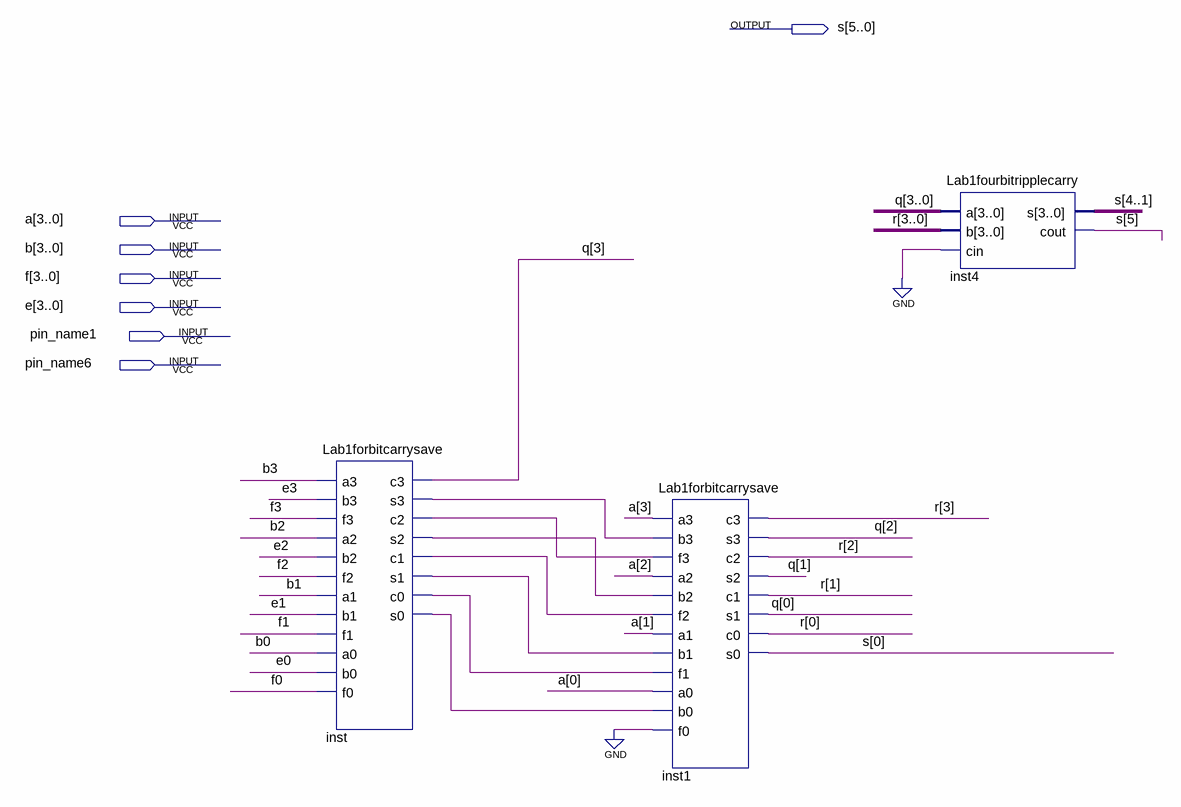
[diagram p0: schematic sheet]
// Quartus schematic forbitcarrysavefor.bdf as structural Verilog: 3 symbols, 7 pins
module forbitcarrysavefor (
  input  [3:0] a,
  input  [3:0] b,
  input  [3:0] f,
  input  [3:0] e,
  input  pin_name1,
  input  pin_name6,
  output [5:0] s
);

  wire inst_c0, inst_c1, inst_c2, inst_s0, inst_s1, inst_s2, inst_s3;
  wire [3:0] q, r;

  Lab1forbitcarrysave inst (
    .a3(b[3]), .b3(e[3]), .f3(f[3]), .a2(b[2]), .b2(e[2]), .f2(f[2]), .a1(b[1]), .b1(e[1]), .f1(f[1]),
    .a0(b[0]), .b0(e[0]), .f0(f[0]), .c3(q[3]), .s3(inst_s3), .c2(inst_c2), .s2(inst_s2), .c1(inst_c1),
    .s1(inst_s1), .c0(inst_c0), .s0(inst_s0));
  Lab1forbitcarrysave inst1 (
    .a3(a[3]), .b3(inst_s3), .f3(inst_c2), .a2(a[2]), .b2(inst_s2), .f2(inst_c1), .a1(a[1]), .b1(inst_s1),
    .f1(inst_c0), .a0(a[0]), .b0(inst_s0), .f0(1'b0), .c3(r[3]), .s3(q[2]), .c2(r[2]), .s2(q[1]), .c1(r[1]),
    .s1(q[0]), .c0(r[0]), .s0(s[0]));
  Lab1fourbitripplecarry inst4 (.a(q), .b(r), .cin(1'b0), .s(s[4:1]), .cout(s[5]));
endmodule
